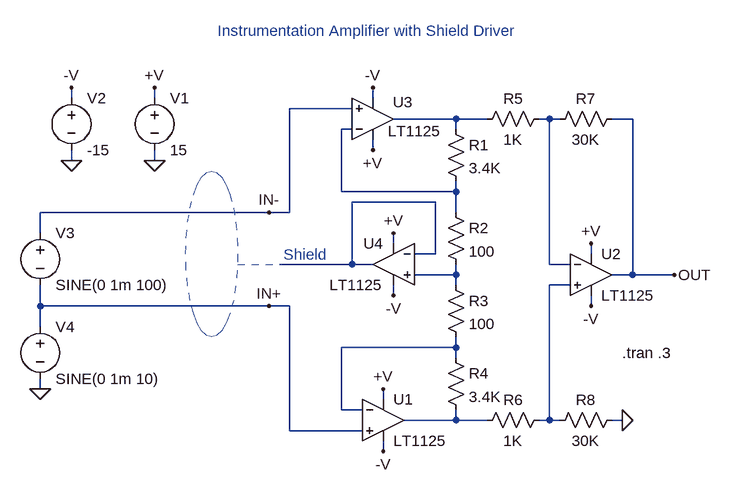
[diagram p0: schematic 1125.asc]
1125.asc, the LTspice schematic file:
Version 4
SHEET 1 896 680
WIRE -288 -144 -288 -160
WIRE -160 -144 -160 -160
WIRE 176 -144 176 -160
WIRE 144 -128 48 -128
WIRE 304 -112 208 -112
WIRE 352 -112 304 -112
WIRE 448 -112 432 -112
WIRE 464 -112 448 -112
WIRE 576 -112 544 -112
WIRE 144 -96 128 -96
WIRE 304 -96 304 -112
WIRE 176 -64 176 -80
WIRE -288 -48 -288 -64
WIRE -160 -48 -160 -64
WIRE 128 0 128 -96
WIRE 304 0 304 -16
WIRE 304 0 128 0
WIRE 272 16 144 16
WIRE 16 32 -336 32
WIRE 48 32 48 -128
WIRE 48 32 16 32
WIRE 304 32 304 0
WIRE -336 64 -336 32
WIRE 208 80 208 64
WIRE 272 96 272 16
WIRE 272 96 240 96
WIRE 512 96 512 80
WIRE 144 112 144 16
WIRE 144 112 32 112
WIRE 176 112 144 112
WIRE 448 112 448 -112
WIRE 480 112 448 112
WIRE 304 128 304 112
WIRE 304 128 240 128
WIRE 576 128 576 -112
WIRE 576 128 544 128
WIRE 640 128 576 128
WIRE 304 144 304 128
WIRE 480 144 448 144
WIRE 208 160 208 144
WIRE -336 176 -336 144
WIRE 16 176 -336 176
WIRE 48 176 16 176
WIRE 512 176 512 160
WIRE -336 208 -336 176
WIRE 304 240 304 224
WIRE 304 240 128 240
WIRE 304 256 304 240
WIRE -336 304 -336 288
WIRE 192 320 192 304
WIRE 128 336 128 240
WIRE 160 336 128 336
WIRE 304 352 304 336
WIRE 304 352 224 352
WIRE 352 352 304 352
WIRE 448 352 448 144
WIRE 448 352 432 352
WIRE 464 352 448 352
WIRE 560 352 544 352
WIRE 48 368 48 176
WIRE 160 368 48 368
WIRE 192 400 192 384
FLAG -160 -48 0
FLAG 192 304 +V
FLAG -160 -160 +V
FLAG 192 400 -V
FLAG -288 -48 0
FLAG -288 -160 -V
FLAG 512 80 +V
FLAG 512 176 -V
FLAG 176 -64 +V
FLAG 176 -160 -V
FLAG 208 64 +V
FLAG 208 160 -V
FLAG 560 352 0
FLAG 640 128 OUT
FLAG -336 304 0
FLAG 16 32 IN-
FLAG 16 176 IN+
SYMBOL voltage -160 -160 R0
SYMATTR InstName V1
SYMATTR Value 15
SYMBOL voltage -288 -160 R0
SYMATTR InstName V2
SYMATTR Value -15
SYMBOL opamps\\LT1125 192 288 R0
SYMATTR InstName U1
SYMBOL opamps\\LT1125 512 64 R0
SYMATTR InstName U2
SYMBOL opamps\\LT1125 176 -48 M180
WINDOW 0 31 90 Left 2
WINDOW 3 23 45 Left 2
SYMATTR InstName U3
SYMBOL res 288 -112 R0
SYMATTR InstName R1
SYMATTR Value 3.4K
SYMBOL res 288 16 R0
SYMATTR InstName R2
SYMATTR Value 100
SYMBOL res 288 128 R0
SYMATTR InstName R3
SYMATTR Value 100
SYMBOL res 288 240 R0
SYMATTR InstName R4
SYMATTR Value 3.4K
SYMBOL opamps\\LT1125 208 48 M0
SYMATTR InstName U4
SYMBOL res 448 -128 R90
WINDOW 0 0 56 VBottom 2
WINDOW 3 32 56 VTop 2
SYMATTR InstName R5
SYMATTR Value 1K
SYMBOL res 448 336 R90
WINDOW 0 0 56 VBottom 2
WINDOW 3 32 56 VTop 2
SYMATTR InstName R6
SYMATTR Value 1K
SYMBOL res 560 -128 R90
WINDOW 0 0 56 VBottom 2
WINDOW 3 32 56 VTop 2
SYMATTR InstName R7
SYMATTR Value 30K
SYMBOL res 560 336 R90
WINDOW 0 0 56 VBottom 2
WINDOW 3 32 56 VTop 2
SYMATTR InstName R8
SYMATTR Value 30K
SYMBOL voltage -336 48 R0
WINDOW 123 0 0 Left 2
WINDOW 39 0 0 Left 2
SYMATTR InstName V3
SYMATTR Value SINE(0 1m 100)
SYMBOL voltage -336 192 R0
WINDOW 123 0 0 Left 2
WINDOW 39 0 0 Left 2
SYMATTR InstName V4
SYMATTR Value SINE(0 1m 10)
TEXT 560 248 Left 2 !.tran .3
TEXT 168 -232 Bottom 2 ;Instrumentation Amplifier with Shield Driver
TEXT 72 112 Bottom 2 ;Shield
LINE Normal -32 112 32 112 2
CIRCLE Normal -32 224 -112 -32 2

The netlist it stands for:
* 1125.asc
V1 +V 0 15
V2 -V 0 -15
XU1 IN+ N007 +V -V N008 LT1125  ; pins In+ In- V+ V- OUT
XU2 N006 N002 +V -V OUT LT1125  ; pins In+ In- V+ V- OUT
XU3 IN- N003 +V -V N001 LT1125  ; pins In+ In- V+ V- OUT
R1 N001 N003 3.4K
R2 N003 N005 100
R3 N005 N007 100
R4 N007 N008 3.4K
XU4 N005 N004 +V -V N004 LT1125  ; pins In+ In- V+ V- OUT
R5 N002 N001 1K
R6 N006 N008 1K
R7 OUT N002 30K
R8 0 N006 30K
V3 IN- IN+ SINE(0 1m 100)
V4 IN+ 0 SINE(0 1m 10)
.tran .3
* Instrumentation Amplifier with Shield Driver
* Shield
.backanno
.end